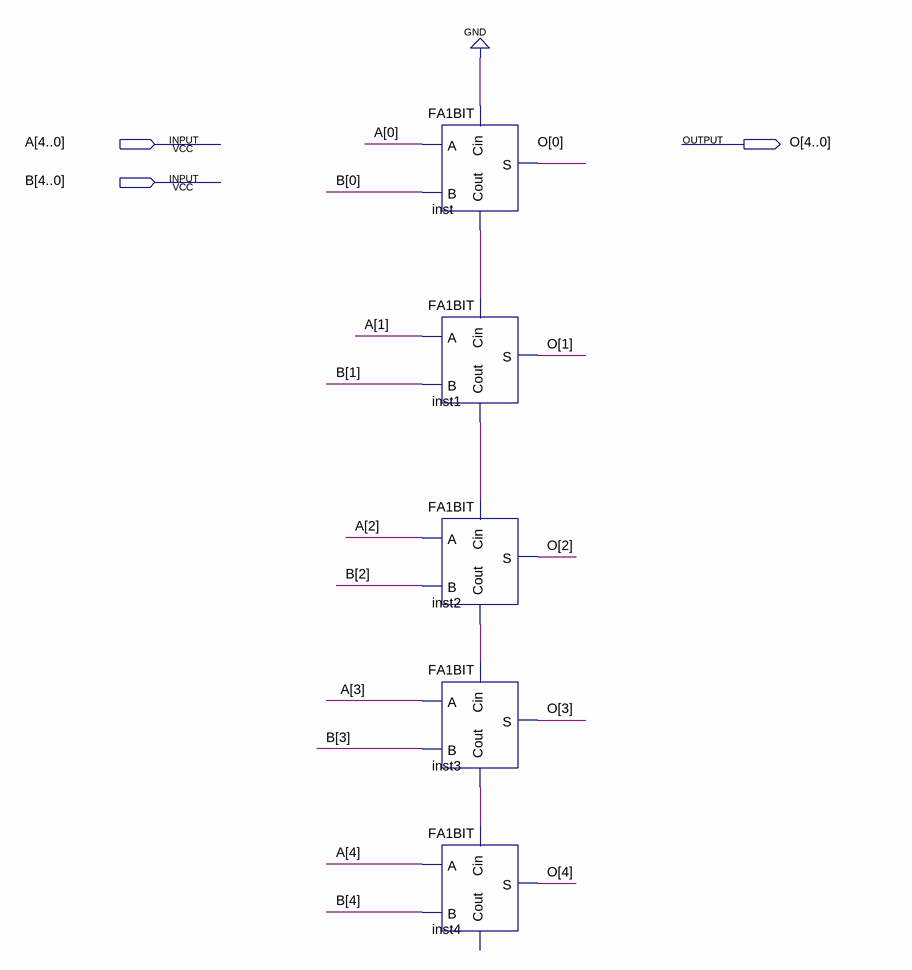
[diagram p0: schematic sheet]
// Quartus schematic ADD5BIT.bdf as structural Verilog: 5 symbols, 3 pins
module ADD5BIT (
  input  [4:0] A,
  input  [4:0] B,
  output [4:0] O
);

  wire inst1_cout, inst2_cout, inst3_cout, inst_cout;

  FA1BIT inst (.A(A[0]), .B(B[0]), .Cin(1'b0), .S(O[0]), .Cout(inst_cout));
  FA1BIT inst1 (.A(A[1]), .B(B[1]), .Cin(inst_cout), .S(O[1]), .Cout(inst1_cout));
  FA1BIT inst2 (.A(A[2]), .B(B[2]), .Cin(inst1_cout), .S(O[2]), .Cout(inst2_cout));
  FA1BIT inst3 (.A(A[3]), .B(B[3]), .Cin(inst2_cout), .S(O[3]), .Cout(inst3_cout));
  FA1BIT inst4 (.A(A[4]), .B(B[4]), .Cin(inst3_cout), .S(O[4]));  // open: Cout
endmodule
